# EAGLE design Pogo Pin Jig (EAGLE 6.4)
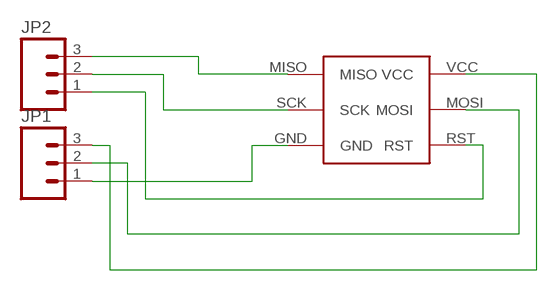
[diagram p0: schematic, sheet 1]

## Parts
JP1  M03PTH  [1X03]
JP2  M03PTH  [1X03]
U$1  POGO_PIN_JIG_SPI  [POGO_PIN_JIG_SPI]

## Nets
N$1: JP1.1 U$1.GND
N$2: JP1.2 U$1.MOSI
N$3: JP1.3 U$1.VCC
N$4: JP2.3 U$1.MISO
N$5: JP2.2 U$1.SCK
N$6: JP2.1 U$1.RST

## Library data of the parts
JP1 JP2 = SparkFun:M03: Header 3 Standard 3-pin 0.1" header. Use with straight break away headers (SKU : PRT-00116), right angle break away headers (PRT-00553), swiss pins (PRT-00743), machine pins (PRT-00117), and female headers (PRT-00115). Molex polarized connector foot print use with SKU : PRT-08232 with associated crimp pins and housings.
U$1 = Random parts:POGO_PIN_JIG_SPI

## Board
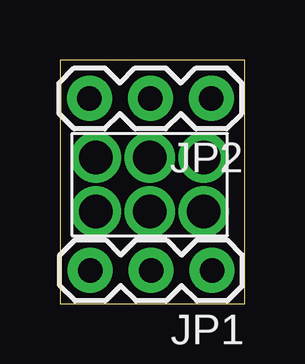
[diagram p1: board, top side]
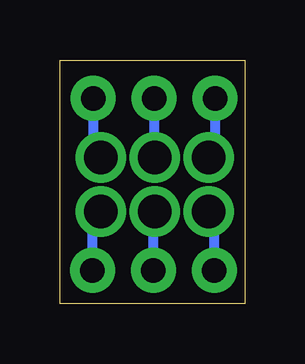
[diagram p2: board, bottom side, seen from below]

Size 7.71 x 10.15 mm. Coordinates in mm from the lower left corner, seen from the top.
Outline: 0,0 7.71,0 7.71,10.15 0,10.15 0,0
Copper layers (1*16): Top 0.035mm / dielectric 1.5mm / Bottom 0.035mm
Design rules "default": minimum track width 10mil, minimum drill 24mil, track to track 8mil, track to pad 8mil, pad to pad 8mil, via to via 8mil, smd to smd 8mil, copper to edge 40mil, drill to drill 8mil, minimum pad ring 10mil, minimum via ring 8mil, stop-mask expansion 4mil, vias tented up to drill 0mil, thermal gap 10mil

### Footprints (pad centres in the part's own frame; a part is rotated, then mirrored left to right if it is on the bottom)
1X03 = drill 1.016 pad 1.88: 1 0,0; 2 2.54,0; 3 5.08,0
POGO_PIN_JIG_SPI = drill 1.4 pad 1.676: GND 1,-5.08; MISO 3.25,-0.58; MOSI 1,-2.83; RST 3.25,-5.08; SCK 3.25,-2.83; VCC 1,-0.58

### Placement (x,y rotation side)
JP1  6.35,1.39 180 top
JP2  6.32,8.55 180 top
U$1  0.92,2.83 90 top

### Tracks (layer width: path | path; a pad name or v marks a point on that pad's centre or on a via)
N$1
  Bottom 0.406: JP1.1 6.35,3.48 U$1.GND
N$2
  Bottom 0.406: JP1.2 3.81,3.77 U$1.MOSI
N$3
  Bottom 0.406: JP1.3 1.27,3.6 U$1.VCC
N$4
  Bottom 0.406: JP2.3 1.24,6.35 U$1.MISO
N$5
  Bottom 0.406: JP2.2 3.78,6.38 3.81,6.35 3.81,6.14 U$1.SCK
N$6
  Bottom 0.406: JP2.1 6.32,6.4 U$1.RST